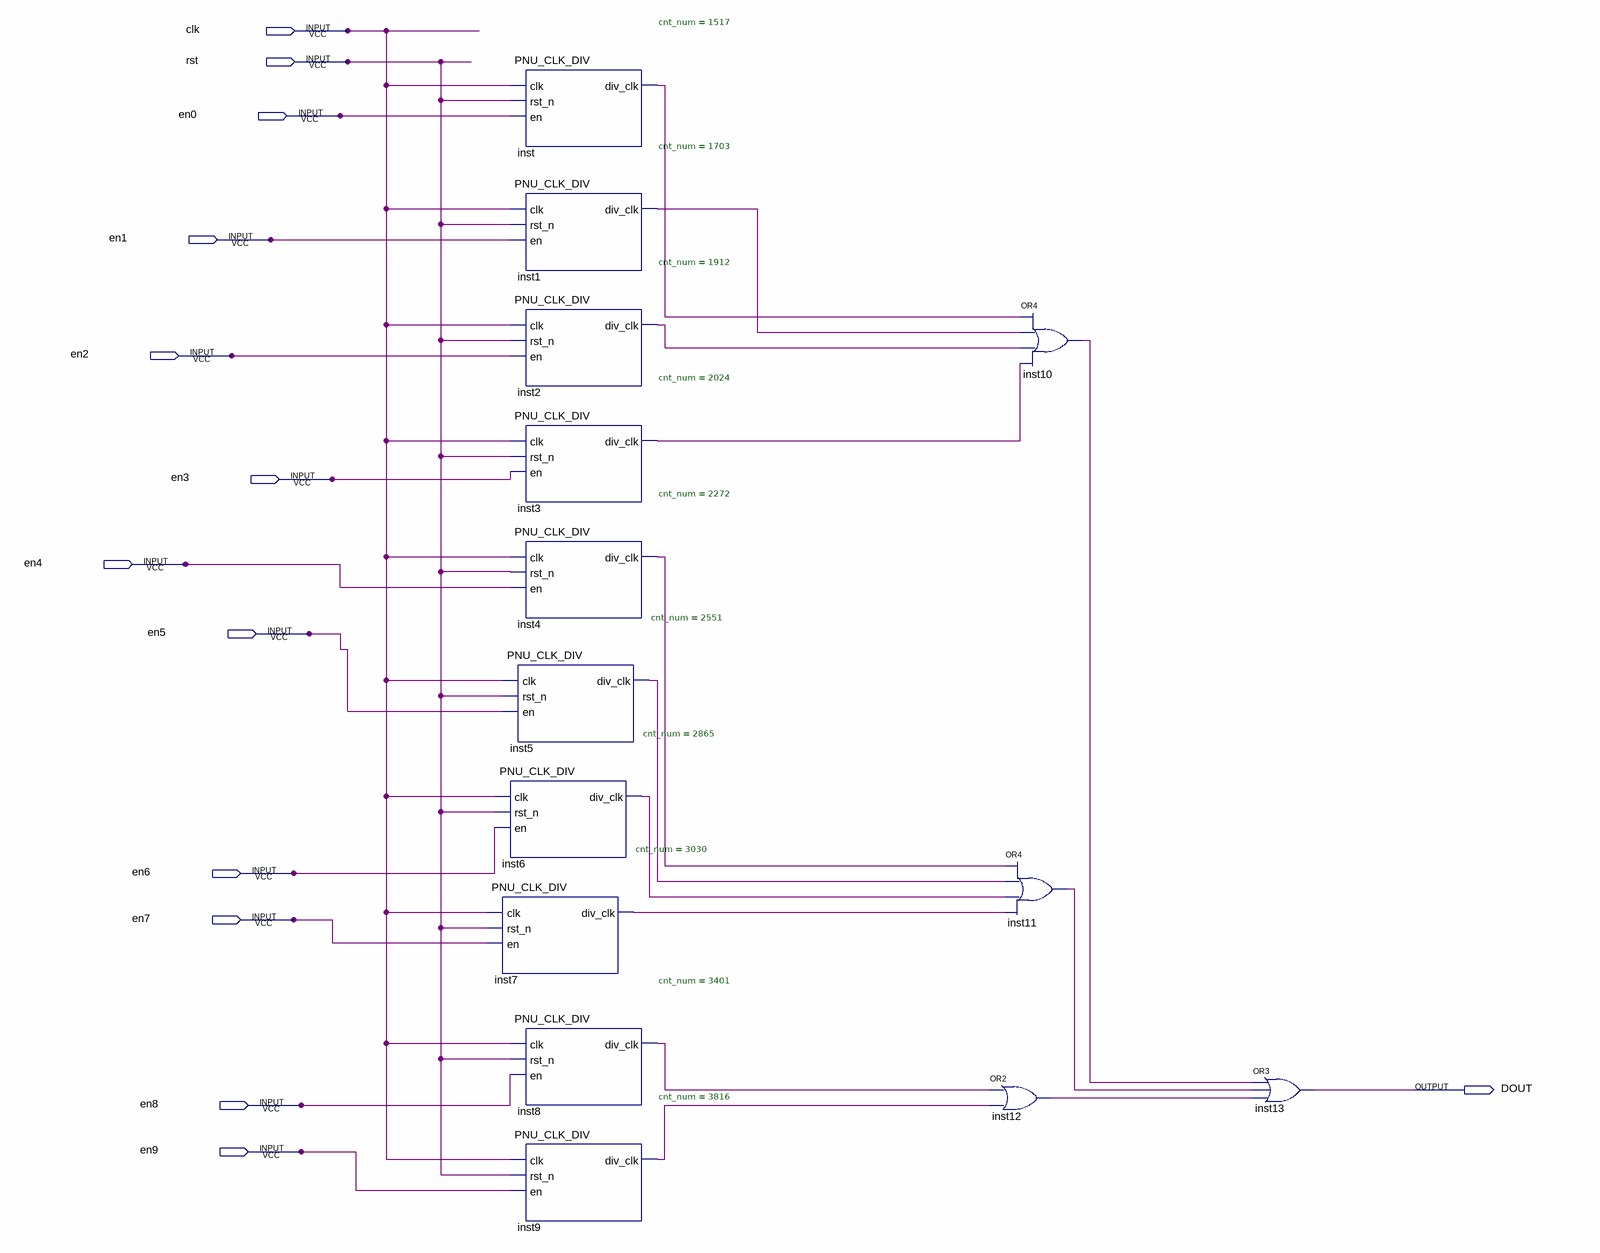
[diagram p0: schematic sheet]
// Quartus schematic piezo.bdf as structural Verilog: 14 symbols, 13 pins
module piezo (
  input  clk,
  input  rst,
  input  en0,
  input  en1,
  input  en2,
  input  en3,
  input  en4,
  input  en5,
  input  en6,
  input  en7,
  input  en8,
  input  en9,
  output DOUT
);

  wire inst1_div_clk, inst2_div_clk, inst3_div_clk, inst4_div_clk, inst5_div_clk, inst6_div_clk,
       inst7_div_clk, inst8_div_clk, inst9_div_clk, inst10_out, inst11_out, inst12_out, inst_div_clk;

  PNU_CLK_DIV #(.cnt_num(2865)) inst6 (.clk(clk), .rst_n(rst), .en(en6), .div_clk(inst6_div_clk));
  PNU_CLK_DIV #(.cnt_num(3030)) inst7 (.clk(clk), .rst_n(rst), .en(en7), .div_clk(inst7_div_clk));
  PNU_CLK_DIV #(.cnt_num(1517)) inst (.clk(clk), .rst_n(rst), .en(en0), .div_clk(inst_div_clk));
  PNU_CLK_DIV #(.cnt_num(1703)) inst1 (.clk(clk), .rst_n(rst), .en(en1), .div_clk(inst1_div_clk));
  PNU_CLK_DIV #(.cnt_num(1912)) inst2 (.clk(clk), .rst_n(rst), .en(en2), .div_clk(inst2_div_clk));
  PNU_CLK_DIV #(.cnt_num(2024)) inst3 (.clk(clk), .rst_n(rst), .en(en3), .div_clk(inst3_div_clk));
  PNU_CLK_DIV #(.cnt_num(2272)) inst4 (.clk(clk), .rst_n(rst), .en(en4), .div_clk(inst4_div_clk));
  PNU_CLK_DIV #(.cnt_num(2551)) inst5 (.clk(clk), .rst_n(rst), .en(en5), .div_clk(inst5_div_clk));
  PNU_CLK_DIV #(.cnt_num(3401)) inst8 (.clk(clk), .rst_n(rst), .en(en8), .div_clk(inst8_div_clk));
  PNU_CLK_DIV #(.cnt_num(3816)) inst9 (.clk(clk), .rst_n(rst), .en(en9), .div_clk(inst9_div_clk));
  or inst12 (inst12_out, inst8_div_clk, inst9_div_clk);
  or inst10 (inst10_out, inst_div_clk, inst1_div_clk, inst2_div_clk, inst3_div_clk);
  or inst11 (inst11_out, inst4_div_clk, inst5_div_clk, inst6_div_clk, inst7_div_clk);
  or inst13 (DOUT, inst10_out, inst11_out, inst12_out);
endmodule
